# Altium schematic sheet sb-sonata-headers1.SchDoc: Header Pins
size Letter; Organization: NewAE Technology Inc.; Address1: 1083 Queen St., Suite 196; Address2: Halifax; Address3: NS; Address4: Canada B3H 0B2; SheetNumber: 4; SheetTotal: 20; SheetApproved: YES
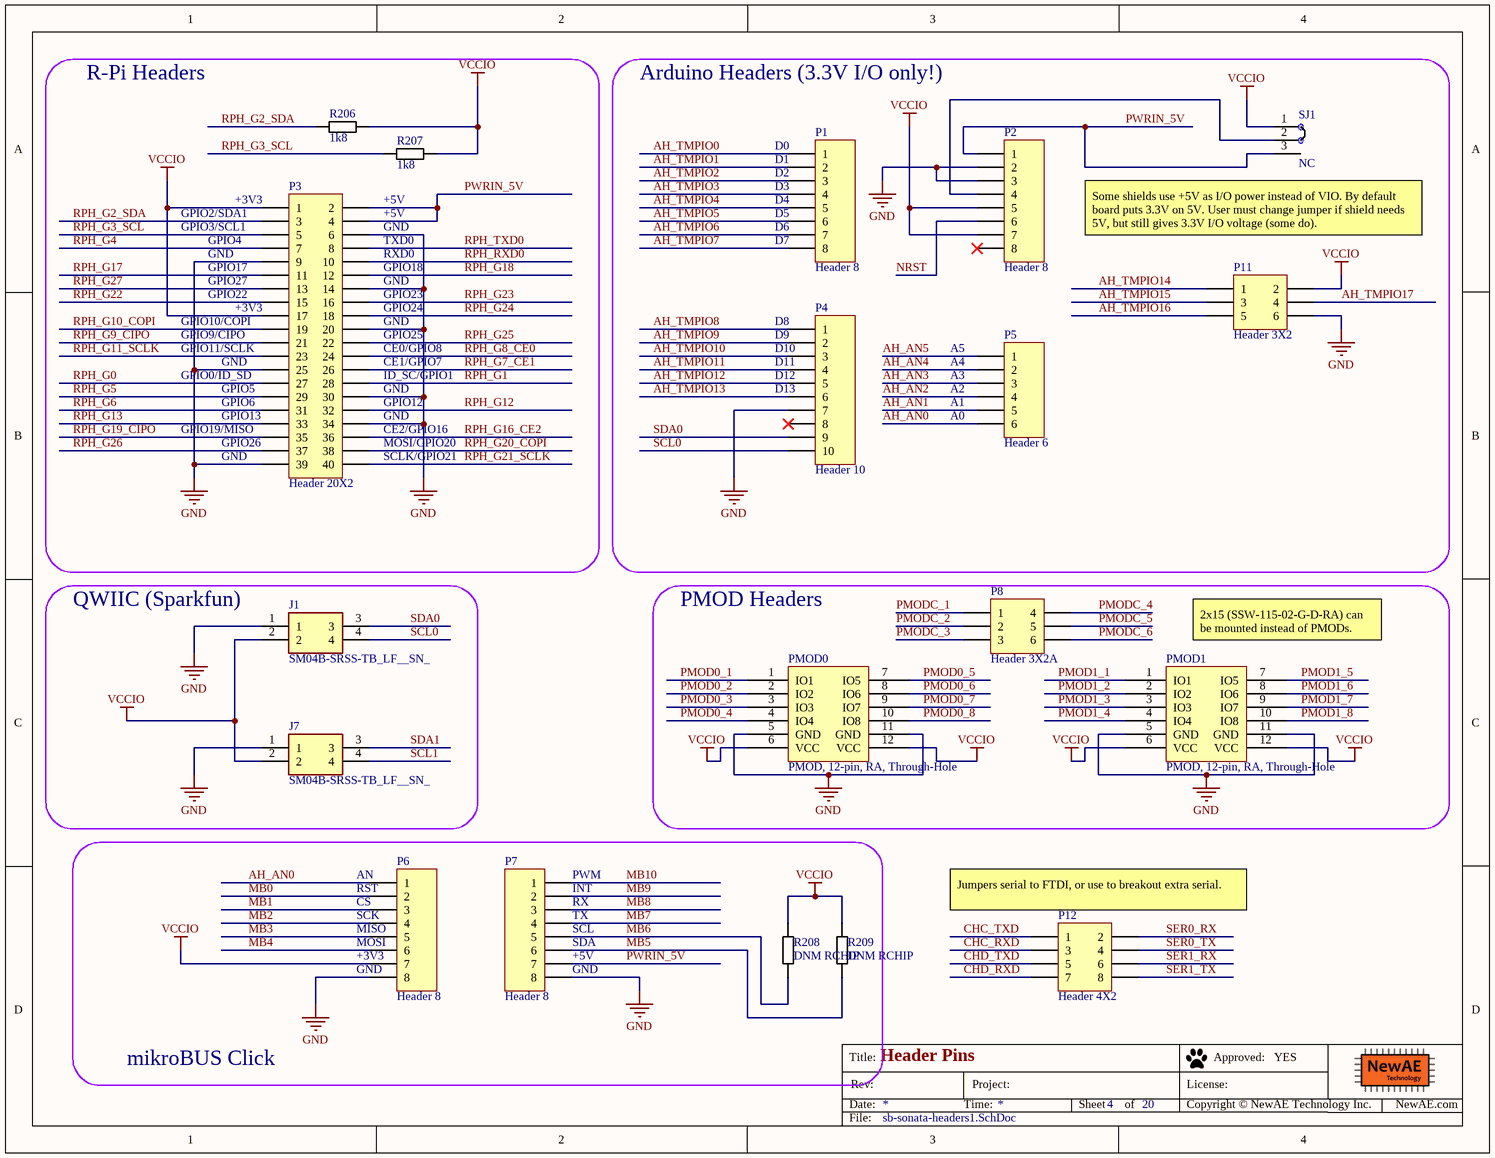
[diagram p0: sb-sonata-headers1.SchDoc]

## Parts
J1  SM04B-SRSS-TB_LF__SN_  [SM04B-SRSS-TB(LFSN)]
J7  SM04B-SRSS-TB_LF__SN_  [SM04B-SRSS-TB(LFSN)]
P1  Header 8  [HDR1X8_SLW-108-01-T-S]
P2  Header 8  [HDR1X8_SLW-108-01-T-S]
P3  Header 20X2  [HDR2X20_861400402YO2LF]
P4  Header 10  [HDR1X10_SLW-110-01-T-S]
P5  Header 6  [HDR1X6_SLW-106-01-T-S]
P6  Header 8  [HDR1X8_SLW-108-01-T-S]
P7  Header 8  [HDR1X8_SLW-108-01-T-S]
P8  Header 3X2A  [HDR2X3_CEN]
P11  Header 3X2  [HDR2X3_XG8T-0641]
P12  Header 4X2  [HDR2X4_XG8T-0841]
PMOD0  PMOD, 12-pin, RA, Through-Hole  [SAMTEC_SSW_106_02_X_D_RA_PMOD]
PMOD1  PMOD, 12-pin, RA, Through-Hole  [SAMTEC_SSW_106_02_X_D_RA_PMOD]
R206  1k8  [RESC1608X55N]
R207  1k8  [RESC1608X55N]
R208  DNM RCHIP  [RESC1608X55N]
R209  DNM RCHIP  [RESC1608X55N]
SJ1  NC  [SJ_3S_NC12]  (no BOM)

## Blocks framed on the sheet
R-Pi Headers: P3 R206 R207
Arduino Headers (3.3V I/O only!): P1 P2 P4 P5 P11 SJ1
QWIIC (Sparkfun): J1 J7
PMOD Headers: P8 PMOD0 PMOD1
mikroBUS Click: P6 P7 R208 R209

## Nets
GND: J1.1 J7.1 P2.2 P2.3 P3.6 P3.9 P3.14 P3.20 P3.25 P3.30 P3.34 P3.39 P4.7 P6.8 P7.8 P11.6 PMOD0.5(GND) PMOD0.11(GND) PMOD1.5(GND) PMOD1.11(GND)
VCCIO: J1.2 J7.2 P2.5 P2.7 P3.1 P3.17 P6.7 P11.2 PMOD0.6(VCC) PMOD0.12(VCC) PMOD1.6(VCC) PMOD1.12(VCC) R206.2 R207.2 R208.1 R209.1 SJ1.1
AH_AN0: P5.6 P6.1
AH_AN1: P5.5
AH_AN2: P5.4
AH_AN3: P5.3
AH_AN4: P5.2
AH_AN5: P5.1
AH_TMPIO0: P1.1
AH_TMPIO1: P1.2
AH_TMPIO2: P1.3
AH_TMPIO3: P1.4
AH_TMPIO4: P1.5
AH_TMPIO5: P1.6
AH_TMPIO6: P1.7
AH_TMPIO7: P1.8
AH_TMPIO8: P4.1
AH_TMPIO9: P4.2
AH_TMPIO10: P4.3
AH_TMPIO11: P4.4
AH_TMPIO12: P4.5
AH_TMPIO13: P4.6
AH_TMPIO14: P11.1
AH_TMPIO15: P11.3
AH_TMPIO16: P11.5
AH_TMPIO17: P11.4
CHC_RXD: P12.3
CHC_TXD: P12.1
CHD_RXD: P12.7
CHD_TXD: P12.5
MB0: P6.2
MB1: P6.3
MB2: P6.4
MB3: P6.5
MB4: P6.6
MB5: P7.6 R209.2
MB6: P7.5 R208.2
MB7: P7.4
MB8: P7.3
MB9: P7.2
MB10: P7.1
NRST: P2.6
PMOD0_1: PMOD0.1(IO1)
PMOD0_2: PMOD0.2(IO2)
PMOD0_3: PMOD0.3(IO3)
PMOD0_4: PMOD0.4(IO4)
PMOD0_5: PMOD0.7(IO5)
PMOD0_6: PMOD0.8(IO6)
PMOD0_7: PMOD0.9(IO7)
PMOD0_8: PMOD0.10(IO8)
PMOD1_1: PMOD1.1(IO1)
PMOD1_2: PMOD1.2(IO2)
PMOD1_3: PMOD1.3(IO3)
PMOD1_4: PMOD1.4(IO4)
PMOD1_5: PMOD1.7(IO5)
PMOD1_6: PMOD1.8(IO6)
PMOD1_7: PMOD1.9(IO7)
PMOD1_8: PMOD1.10(IO8)
PMODC_1: P8.1
PMODC_2: P8.2
PMODC_3: P8.3
PMODC_4: P8.4
PMODC_5: P8.5
PMODC_6: P8.6
PWRIN_5V: P2.1 P3.2 P3.4 P7.7 SJ1.3
RPH_G0: P3.27
RPH_G1: P3.28
RPH_G2_SDA: P3.3 R206.1
RPH_G3_SCL: P3.5 R207.1
RPH_G4: P3.7
RPH_G5: P3.29
RPH_G6: P3.31
RPH_G7_CE1: P3.26
RPH_G8_CE0: P3.24
RPH_G9_CIPO: P3.21
RPH_G10_COPI: P3.19
RPH_G11_SCLK: P3.23
RPH_G12: P3.32
RPH_G13: P3.33
RPH_G16_CE2: P3.36
RPH_G17: P3.11
RPH_G18: P3.12
RPH_G19_CIPO: P3.35
RPH_G20_COPI: P3.38
RPH_G21_SCLK: P3.40
RPH_G22: P3.15
RPH_G23: P3.16
RPH_G24: P3.18
RPH_G25: P3.22
RPH_G26: P3.37
RPH_G27: P3.13
RPH_RXD0: P3.10
RPH_TXD0: P3.8
SCL0: J1.4 P4.10
SCL1: J7.4
SDA0: J1.3 P4.9
SDA1: J7.3
SER0_RX: P12.2
SER0_TX: P12.4
SER1_RX: P12.6
SER1_TX: P12.8
NetP2_4: P2.4 SJ1.2

Not connected (* = marked no-connect by the designer): P2 8*; P4 8*

## Notes on the sheet
- (near P1) D0
- (near P1) D1
- (near P3) GPIO2/SDA1
- (near P3) GPIO3/SCL1
- (near P3) +3V3
- +5V
- (near P3) GND
- (near P1) D2
- (near P1) D3
- (near P1) D4
- (near P1) D5
- (near P1) D6
- (near SJ1) Some shields use +5V as I/O power instead of VIO. By default board puts 3.3V on 5V. User must change jumper if shield needs 5V, but still gives 3.3V I/O voltage (some do).
- (near P3) GPIO4
- GND
- (near P3) GPIO17
- (near P3) GPIO27
- (near P3) GPIO22
- (near P3) TXD0
- (near P3) RXD0
- (near P3) GPIO18
- (near P3) GPIO23
- (near P1) D7
- (near P3) GPIO10/COPI
- (near P3) GPIO9/CIPO
- (near P3) GPIO11/SCLK
- (near P3) GPIO24
- (near P3) GPIO25
- (near P3) CE0/GPIO8
- (near P3) CE1/GPIO7
- (near P4) D8
- (near P4) D9
- (near P4) D10
- (near P4) D11
- (near P5) A4
- (near P5) A5
- (near P3) GPIO0/ID_SD
- (near P3) GPIO19/MISO
- (near P3) GPIO5
- (near P3) GPIO6
- (near P3) GPIO13
- (near P3) ID_SC/GPIO1
- (near P3) GPIO12
- (near P3) CE2/GPIO16
- (near P4) D12
- (near P4) D13
- (near P5) A0
- (near P5) A1
- (near P5) A2
- (near P5) A3
- (near P3) GPIO26
- (near P3) MOSI/GPIO20
- (near P3) SCLK/GPIO21
- (near PMOD1) 2x15 (SSW-115-02-G-D-RA) can be mounted instead of PMODs.
- (near P6) AN
- (near P6) RST
- (near P6) CS
- (near P7) RX
- (near P7) INT
- (near P7) PWM
- (near P12) Jumpers serial to FTDI, or use to breakout extra serial.
- (near P6) SCK
- (near P6) MISO
- (near P6) MOSI
- (near P6) +3V3
- (near P6) GND
- (near P7) GND
- (near P7) +5V
- (near P7) SDA
- (near P7) SCL
- (near P7) TX
- Title:
- Date:
- Rev:
- Time:
- Project:
- Sheet
- of
- License:
- Copyright © NewAE Technology Inc.
- Approved:
- NewAE.com
- File:

## Library data of the parts
J1 J7 = SM04B-SRSS-TB_LF__SN_: Connector; Manufacturer_Name: JST (JAPAN SOLDERLESS TERMINALS); Manufacturer_Part_Number: SM04B-SRSS-TB(LF)(SN); Datasheet Link: http://www.jst-mfg.com/product/pdf/eng/eSH.pdf; Arrow Part Number: SM04B-SRSS-TB(LF)(SN); Arrow Price/Stock: https://www.arrow.com/en/products/sm04b-srss-tb-lf-sn/jst-manufacturing?region=europe
P1 P2 P6 P7 = Header 8: Header, 8-Pin; LatestRevisionDate: 17-Jul-2002; LatestRevisionNote: Re-released for DXP Platform.; Publisher: Altium Limited
P3 = Header 20X2: Header, 20-Pin, Dual row; LatestRevisionDate: 17-Jul-2002; LatestRevisionNote: Re-released for DXP Platform.; Publisher: Altium Limited
P4 = Header 10: Header, 10-Pin; LatestRevisionDate: 17-Jul-2002; LatestRevisionNote: Re-released for DXP Platform.; Publisher: Altium Limited
P5 = Header 6: Header, 6-Pin; LatestRevisionDate: 17-Jul-2002; LatestRevisionNote: Re-released for DXP Platform.; Publisher: Altium Limited
P8 = Header 3X2A: Header, 3-Pin, Dual row; LatestRevisionDate: 17-Jul-2002; LatestRevisionNote: Re-released for DXP Platform.; Publisher: Altium Limited
P11 = Header 3X2: Header, 3-Pin, Dual row; LatestRevisionDate: 17-Jul-2002; LatestRevisionNote: Re-released for DXP Platform.; Publisher: Altium Limited
P12 = Header 4X2: Header, 4-Pin, Dual row; LatestRevisionDate: 17-Jul-2002; LatestRevisionNote: Re-released for DXP Platform.; Publisher: Altium Limited
PMOD0 PMOD1 = PMOD_2ROW_FEMALERATH: Component Group: Connector; PP Material Stack: 0; Part Number: PMOD_2ROW_FEMALERATH; Pin Count: 12; Supplier 1: Digi-Key; Supplier Part Number 1: SAM1215-06-ND; Component Kind: Standard; Component Type: Standard; PP Rotation: 0; PP Rotation1: 0
R206 R207 = RCHIP-1K8-0603: 1k8 res, 0603, 1%, 1/10W; Manufacture 1: Yageo; Manufacture Part Number 1: RC0603FR-071K8L; Component Group: Resistor; Case-EIA: 0603; Case-Metric: 1608; Rated Power: 0.1W; Rated Voltage: 75VDC; Part Number: RCHIP-1K8-0603; Footprint: 0603; Pin Count: 2; Supplier 1: Digi-Key; Supplier Part Number 1: 311-1.80KHRCT-ND; Value: 1k8; Tolerance: 1%; Mounting Technology: SMT; Temperature Range: -55C to 155C; Component Kind: Standard; Component Type: Standard
R208 R209 = RCHIP-DNM-0603: Do Not Mount Resistor; Case-EIA: 0603; Case-Metric: 1608; Part Number: RCHIP-DNM-0603; Component Group: Resistor; Footprint: 0603; Pin Count: 2; Mounting Technology: SMT; Component Kind: Standard; Component Type: Standard
SJ1 = SJ_3S_12JMP: Solder Jumper, NC; Component Group: PCB Feature; Part Number: SJ_3S_12JMP; Pin Count: 3; Mounting Technology: COPPER; Component Type: Standard (No BOM)